# EAGLE design vfd_drive (EAGLE 9.2.2)
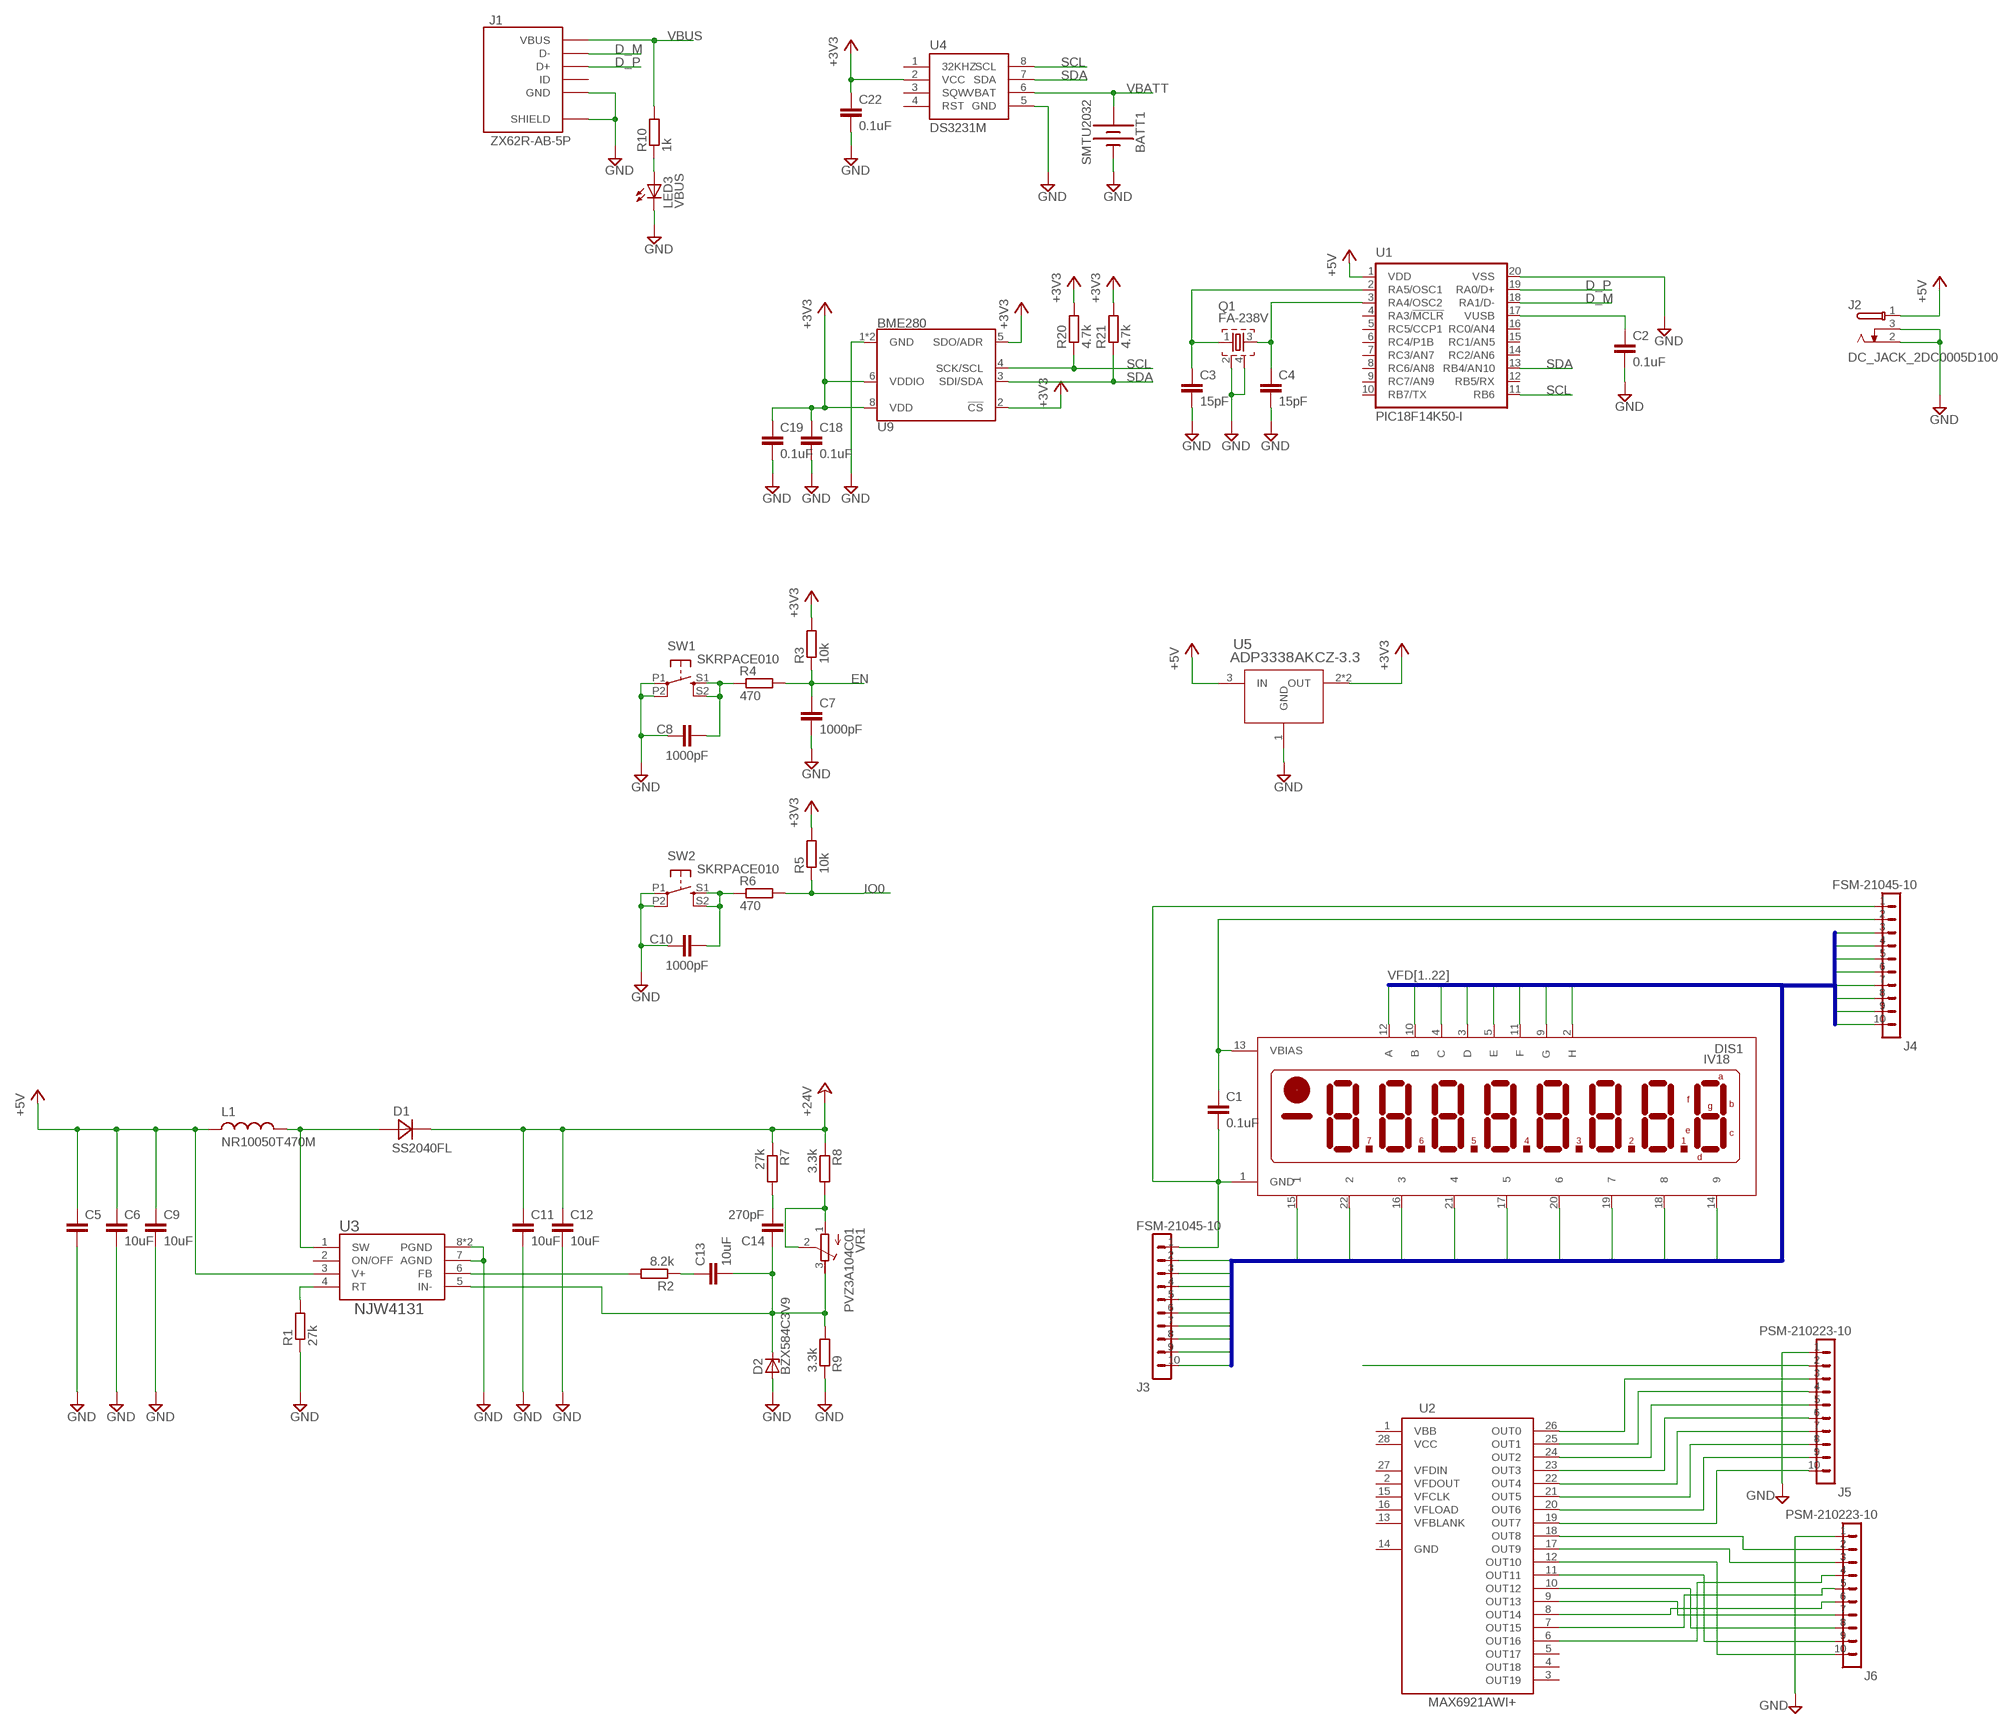
[diagram p0: schematic, sheet 1]

## Parts
BATT1  SMTU2032  [SMTU2032]
C1  0.1uF  C-EUC0603  [C0603]
C2  0.1uF  C-EUC0603  [C0603]
C3  15pF  C-EUC0603  [C0603]
C4  15pF  C-EUC0603  [C0603]
C5  C-EUC3225  [C3225]
C6  10uF  C-EUC0603  [C0603]
C7  1000pF  C-EUC0603  [C0603]
C8  1000pF  C-EUC0603  [C0603]
C9  10uF  C-EUC0603  [C0603]
C10  1000pF  C-EUC0603  [C0603]
C11  10uF  C-EUC3216  [C3216]
C12  10uF  C-EUC3216  [C3216]
C13  10uF  C-EUC0603  [C0603]
C14  270pF  C-EUC0603  [C0603]
C18  0.1uF  C-EUC0603  [C0603]
C19  0.1uF  C-EUC0603  [C0603]
C22  0.1uF  C-EUC0603  [C0603]
D1  SS2040FL  [SOD-123FL]
D2  BZX584C3V9  [SOD-523]
DIS1  IV18  [IV18]
J1  ZX62R-AB-5P  [ZX62R-B-5PA]
J2  DC_JACK_2DC0005D100  [DC_JACK_2DC0005D100]
J3  FSM-21045-10  [FSM-21045-10]
J4  FSM-21045-10  [FSM-21045-10]
J5  PSM-210223-10  [PSM-210223-10]
J6  PSM-210223-10  [PSM-210223-10]
L1  NR10050T470M  [NR10050T100M]
LED3  VBUS  LEDCHIPLED_0603  [CHIPLED_0603]
Q1  FA-238V  [FA238-V]
R1  27k  R-EU_R0603  [R0603]
R2  8.2k  R-EU_R0603  [R0603]
R3  10k  R-EU_R0603  [R0603]
R4  470  R-EU_R0603  [R0603]
R5  10k  R-EU_R0603  [R0603]
R6  470  R-EU_R0603  [R0603]
R7  27k  R-EU_R0603  [R0603]
R8  3.3k  R-EU_R0603  [R0603]
R9  3.3k  R-EU_R0603  [R0603]
R10  1k  R-EU_R0603  [R0603]
R20  4.7k  R-EU_R0603  [R0603]
R21  4.7k  R-EU_R0603  [R0603]
SW1  SKRPACE010  [SKRPACE010]
SW2  SKRPACE010  [SKRPACE010]
U1  PIC18F14K50-I  [SSOP20]
U2  MAX6921AWI+  [SOIC-28-MI]
U3  NJW4131  [HSOP8]
U4  DS3231M  [SO08]
U5  ADP3338AKCZ-3.3  [SOT233]
U9  BME280  [LGA-8-2.5X2.5]
VR1  PVZ3A104C01  [PVZ3A]

## Nets
+3V3 [POWER]: C18.1 C19.1 C22.1 R3.2 R5.2 R20.2 R21.2 U4.2(VCC) U5.2(OUT) U5.4(OUT) U9.2(!CS) U9.5(SDO/ADR) U9.6(VDDIO) U9.8(VDD)
+5V: C5.1 C6.1 C9.1 J2.1 L1.P$1 U1.1(VDD) U3.3(V+) U5.3(IN)
+24V: C11.1 C12.1 D1.K(C) R7.1 R8.1
D_M [diffrencial pair]: J1.D- U1.18(RA1/D-)
D_P [diffrencial pair]: J1.D+ U1.19(RA0/D+)
EN: C7.1 R3.1 R4.2
GND: BATT1.N(-) C1.2 C2.2 C3.2 C4.2 C5.2 C6.2 C7.2 C8.1 C9.2 C10.1 C11.2 C12.2 C18.2 C19.2 C22.2 D2.A DIS1.1(GND) J1.GND J1.SHIELD@1(SHIELD) J1.SHIELD@2(SHIELD) J1.SHIELD@3(SHIELD) J1.SHIELD@4(SHIELD) J2.2 J2.3 J3.1 J4.1 J5.1 J6.1 LED3.C Q1.2 Q1.4 R1.1 R9.1 SW1.P1(P) SW1.P2(P1) SW2.P1(P) SW2.P2(P1) U1.20(VSS) U3.7(AGND) U3.8(PGND) U3.PAD(PGND) U4.5(GND) U5.1(GND) U9.1(GND) U9.7(GND)
IO0: R5.1 R6.2
N$6: C8.2 R4.1 SW1.S1(S) SW1.S2(S1)
N$12: C10.2 R6.1 SW2.S1(S) SW2.S2(S1)
N$13: LED3.A R10.1
N$21: J5.3 U2.26(OUT0)
N$22: J5.4 U2.25(OUT1)
N$23: J5.5 U2.24(OUT2)
N$24: J5.6 U2.23(OUT3)
N$25: J5.7 U2.22(OUT4)
N$26: J5.8 U2.21(OUT5)
N$27: J5.9 U2.20(OUT6)
N$28: J5.10 U2.19(OUT7)
N$29: J6.2 U2.18(OUT8)
N$30: J6.7 U2.9(OUT13)
N$31: J6.8 U2.10(OUT12)
N$32: J6.9 U2.11(OUT11)
N$33: J6.10 U2.12(OUT10)
N$34: J6.3 U2.17(OUT9)
N$35: J6.6 U2.8(OUT14)
N$36: J6.5 U2.7(OUT15)
N$37: J6.4 U2.6(OUT16)
N$38: J5.2
N$39: C2.1 U1.17(VUSB)
N$40: R1.2 U3.4(RT)
N$41: D1.A L1.P$2 U3.1(SW)
N$43: R2.2 U3.6(FB)
N$44: C3.1 Q1.1 U1.2(RA5/OSC1)
N$45: C4.1 Q1.3 U1.3(RA4/OSC2)
N$46: C13.1 R2.1
N$47: C13.2 C14.1 D2.K(C) R9.2 U3.5(IN-) VR1.3(A)
N$48: C14.2 R7.2
N$49: R8.2 VR1.1(E) VR1.2(S)
SCL: R20.1 U1.11(RB6) U4.8(SCL) U9.4(SCK/SCL)
SDA: R21.1 U1.13(RB4/AN10) U4.7(SDA) U9.3(SDI/SDA)
VBATT: BATT1.P(+) U4.6(VBAT)
VBIAS: C1.1 DIS1.13(VBIAS) J4.2
VBUS: J1.VCC(VBUS) R10.2
VFD2: DIS1.2(H) J3.5
VFD3: DIS1.3(D) J3.4
VFD4: DIS1.4(C) J3.3
VFD5: DIS1.5(E) J3.2
VFD9: DIS1.9(G) J4.3
VFD10: DIS1.10(B) J4.4
VFD11: DIS1.11(F) J4.5
VFD12: DIS1.12(A) J4.6
VFD14: DIS1.14 J4.7
VFD15: DIS1.15 J4.8
VFD16: DIS1.16 J4.9
VFD17: DIS1.17 J4.10
VFD18: DIS1.18 J3.10
VFD19: DIS1.19 J3.9
VFD20: DIS1.20 J3.8
VFD21: DIS1.21 J3.7
VFD22: DIS1.22 J3.6
Unconnected: J1.ID U1.4(RA3/!MCLR!) U1.5(RC5/CCP1) U1.6(RC4/P1B) U1.7(RC3/AN7) U1.8(RC6/AN8) U1.9(RC7/AN9) U1.10(RB7/TX) U1.12(RB5/RX) U1.14(RC2/AN6) U1.15(RC1/AN5) U1.16(RC0/AN4) U2.1(VBB) U2.2(VFDOUT) U2.3(OUT19) U2.4(OUT18) U2.5(OUT17) U2.13(VFBLANK) U2.14(GND) U2.15(VFCLK) U2.16(VFLOAD) U2.27(VFDIN) U2.28(VCC) U3.2(ON/OFF) U4.1(32KHZ) U4.3(SQW) U4.4(RST)

## Buses
VFD[1..22]

## Library data of the parts
BATT1 = taki-library:SMTU2032
C1-C14 C18 C19 C22 = taki-library:C-EU: CAPACITOR, European symbol
D1 = taki-library:SS2040FL
D2 = taki-library:BZX584C3V9
DIS1 = taki-library:IV18: LCD DISPLAY 8-character 7 segment
J1 = taki-library:ZX62
J2 = taki-library:DC_JACK_2DC0005D100: AKIZUKIDENSHI 2DC-0005D100 SINGATRON ENTERPRISE CO., LTD http://akizukidenshi.com/download/2DC-0005D100.pdf
J3 J4 = taki-library:FSM-21045-10
J5 J6 = taki-library:PSM-210223-10
L1 = taki-library:NR10050T470M
LED3 = taki-library:LED: LED OSRAM: - CHIPLED LG R971, LG N971, LY N971, LG Q971, LY Q971, LO R971, LY R971 LH N974, LH R974 LS Q976, LO Q976, LY Q976 LO Q996 - Hyper CHIPLED LW Q18S LB Q993, LB Q99A, LB R99A - SideLED LS A670, LO A670, LY A670, LG A670, LP A670 LB A673, LV A673, LT A673, LW A673 LH A674 LY A675 LS A676, LA A676, LO A676, LY A676, LW A676 LS A679, LY A679, LG A679 - Hyper Micro SIDELED® LS Y876, LA Y876, LO Y876, LY Y876 LT Y87S - SmartLED LW L88C, LW L88S LB L89C, LB L89S, LG L890 LS L89K, LO L89K, LY L89K LS L896, LA L896, LO L896, LY L896 - TOPLED LS T670, LO T670, LY T670, LG T670, LP T670 LSG T670, LSP T670, LSY T670, LOP T670, LYG T670 LG T671, LOG T671, LSG T671 LB T673, LV T673, LT T673, LW T673 LH T674 LS T676, LA T676, LO T676, LY T676, LB T676, LH T676, LSB T676, LW T676 LB T67C, LV T67C, LT T67C, LS T67K, LO T67K, LY T67K, LW E67C LS E67B, LA E67B, LO E67B, LY E67B, LB E67C, LV E67C, LT E67C LW T67C LS T679, LY T679, LG T679 LS T770, LO T770, LY T770, LG T770, LP T770 LB T773, LV T773, LT T773, LW T773 LH T774 LS E675, LA E675, LY E675, LS T675 LS T776, LA T776, LO T776, LY T776, LB T776 LHGB T686 LT T68C, LB T68C - Hyper Mini TOPLED® LB M676 - Mini TOPLED Santana® LG M470 LS M47K, LO M47K, LY M47K Source: http://www.osram.convergy.de LUXEON: - LUMILED® LXK2-PW12-R00, LXK2-PW12-S00, LXK2-PW14-U00, LXK2-PW14-V00 LXK2-PM12-R00, LXK2-PM12-S00, LXK2-PM14-U00 LXK2-PE12-Q00, LXK2-PE12-R00, LXK2-PE12-S00, LXK2-PE14-T00, LXK2-PE14-U00 LXK2-PB12-K00, LXK2-PB12-L00, LXK2-PB12-M00, LXK2-PB14-N00, LXK2-PB14-P00, LXK2-PB14-Q00 LXK2-PR12-L00, LXK2-PR12-M00, LXK2-PR14-Q00, LXK2-PR14-R00 LXK2-PD12-Q00, LXK2-PD12-R00, LXK2-PD12-S00 LXK2-PH12-R00, LXK2-PH12-S00 LXK2-PL12-P00, LXK2-PL12-Q00, LXK2-PL12-R00 Source: www.luxeon.com KINGBRIGHT: KA-3528ASYC Source: www.kingbright.com
Q1 = taki-library:FA-238V
R1-R10 R20 R21 = taki-library:R-EU_: RESISTOR, European symbol
SW1 SW2 = taki-library:SKRPACE010
U1 = taki-library:PIC18F14K50-I
U2 = taki-library:MAX6921AWI+
U3 = taki-library:NJW4131
U4 = taki-library:DS3231M: DS3231M Real Time Clock Accuracy +/-5ppm. Battery Backup. 2.3V to 5.5V. Datasheet <https://cdn.sparkfun.com/datasheets/Dev/Beagle/DS3231M.pdf> SparkFun Products CryptoCape <https://www.sparkfun.com/products/12773> (DEV-12773) SparkFun CryptoShield <https://www.sparkfun.com/products/13183> (DEV-13183); PROD_ID: IC-11985
U5 = taki-library:ADP3338AKCZ-3.3
U9 = taki-library:BME280: Bosch BME280 – Combined Humidity and Pressure Sensor The BME280 is as combined digital humidity, pressure and temperature sensor based on proven sensing principles. The sensor module is housed in an extremely compact metal-lid LGA package with a footprint of only 2.5×2.5mm² with a height of 0.93mm. Its small dimensions and its low power consumption allow the implementation in battery driven devices such as handsets, GPS modules or watches. Datasheet <https://cdn.sparkfun.com/assets/learn_tutorials/4/1/9/BST-BME280_DS001-10.pdf> SparkFun Products SparkFun Atmospheric Sensor Breakout - BME280 <https://www.sparkfun.com/products/13676> (SEN-13676); PROD_ID: IC-13090
VR1 = taki-library:PVZ3A104C01

## Net classes
0 default: width 0.152 mm
1 POWER: width 0.254 mm
2 diffrencial pair: width 0.15 mm, clearance 0.3 mm to class 0, clearance 0.3 mm to class 1, clearance 0.15 mm
3 3pin digital: width 0.15 mm
4 high-voltage: width 0.3 mm, clearance 0.7 mm to class 0, clearance 0.7 mm to class 1, clearance 0.7 mm to class 2, clearance 0.7 mm to class 3, clearance 0.7 mm

## Board
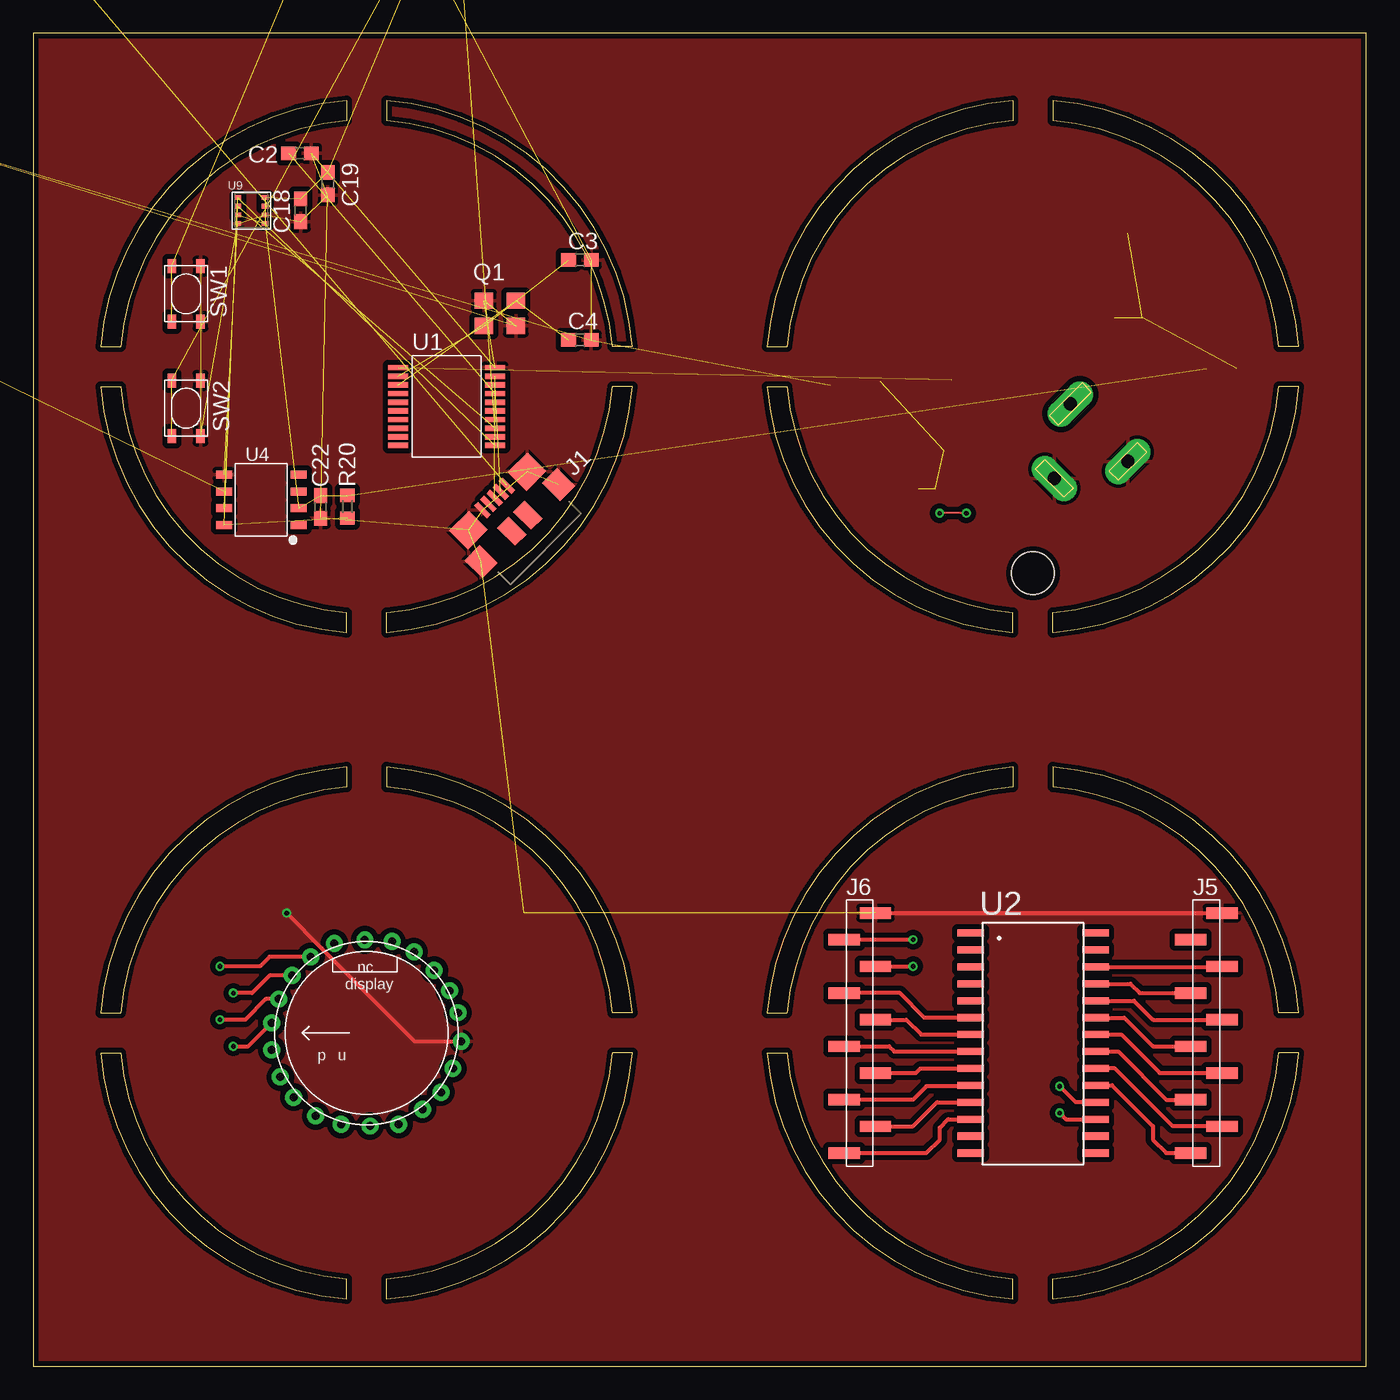
[diagram p1: board, top side]
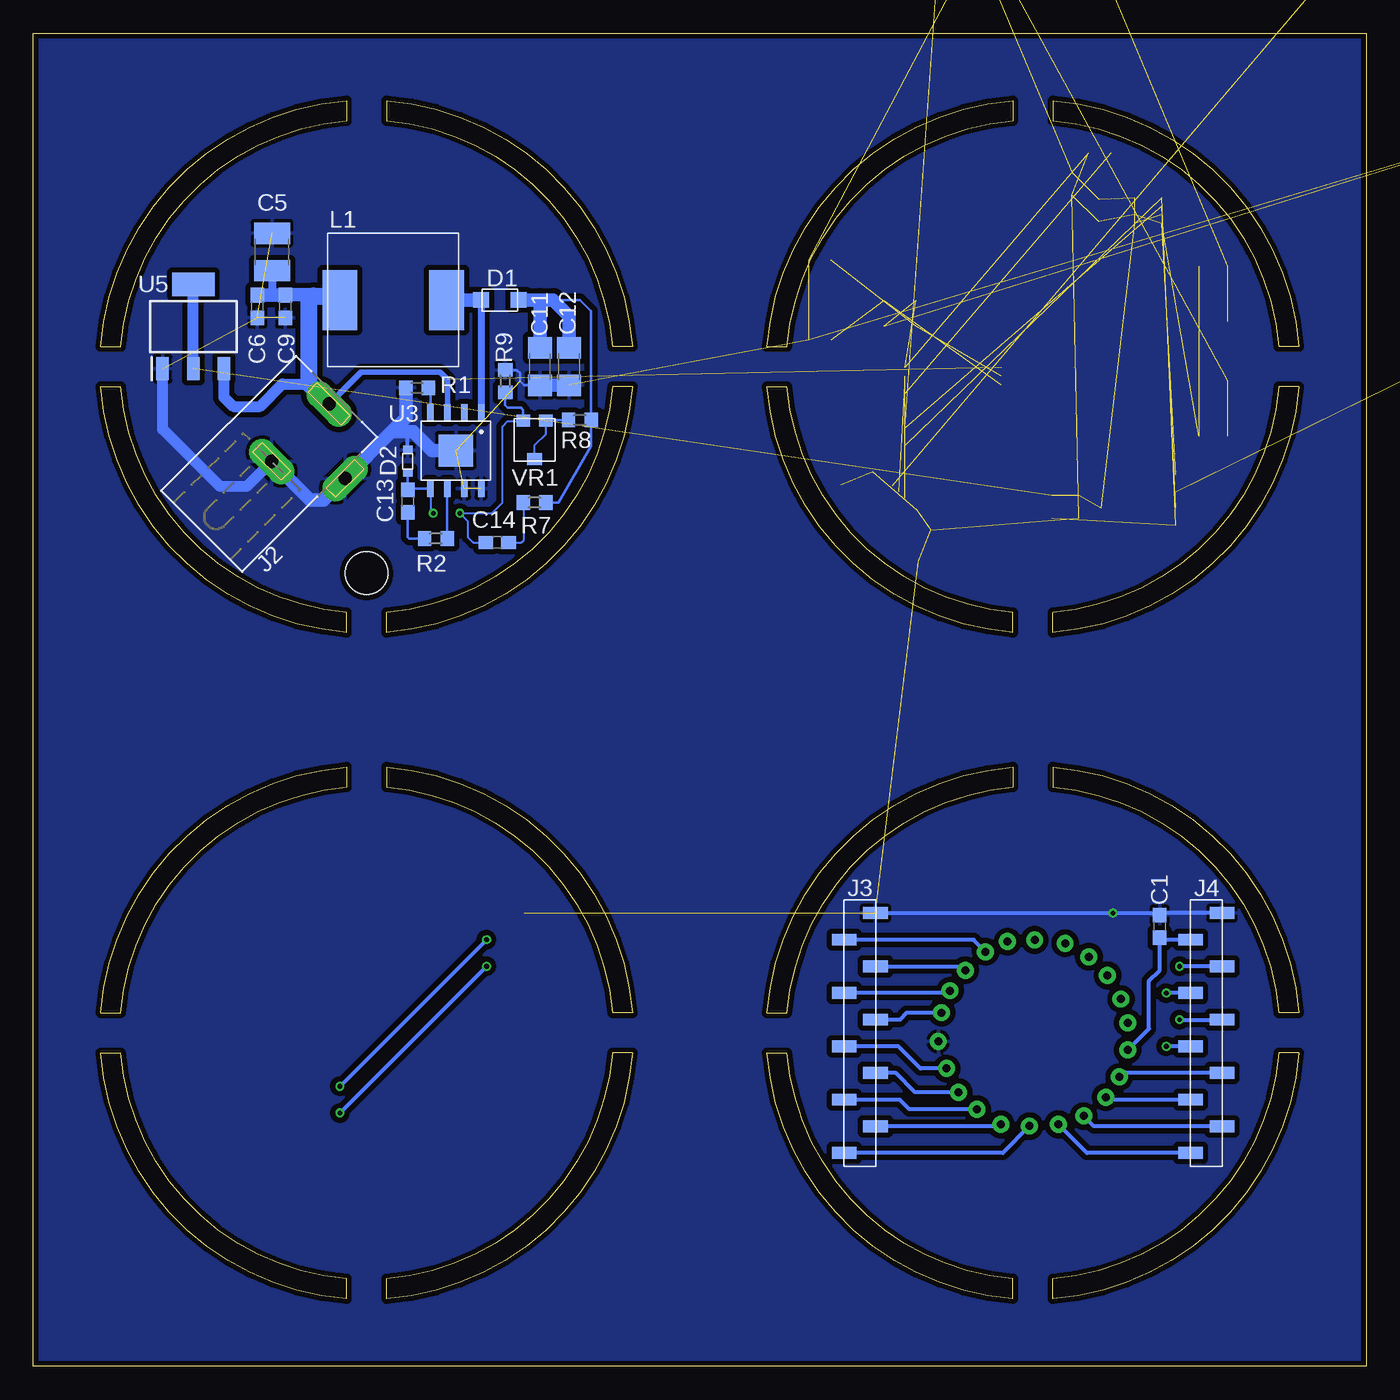
[diagram p2: board, bottom side, seen from below]

Size 100 x 100 mm. Coordinates in mm from the lower left corner, seen from the top.
Outline: 23.5,43.44 arc81 6.56,26.5 5.06,26.5 arc-81 23.5,44.94 23.5,43.44
Outline: 43.44,26.5 arc81 26.5,43.44 26.5,44.94 arc-81 44.94,26.5 43.44,26.5
Outline: 6.56,23.5 arc81 23.5,6.56 23.5,5.06 arc-81 5.06,23.5 6.56,23.5
Outline: 26.5,6.56 arc81 43.44,23.5 44.94,23.5 arc-81 26.5,5.06 26.5,6.56
Outline: 56.56,23.5 arc81 73.5,6.56 73.5,5.06 arc-81 55.06,23.5 56.56,23.5
Outline: 0,0 100,0 100,100 0,100 0,0
Outline: 73.5,43.44 arc81 56.56,26.5 55.06,26.5 arc-81 73.5,44.94 73.5,43.44
Outline: 76.5,6.56 arc81 93.44,23.5 94.94,23.5 arc-81 76.5,5.06 76.5,6.56
Outline: 93.44,26.5 arc81 76.5,43.44 76.5,44.94 arc-81 94.94,26.5 93.44,26.5
Outline: 76.5,56.56 arc81 93.44,73.5 94.94,73.5 arc-81 76.5,55.06 76.5,56.56
Outline: 56.56,73.5 arc81 73.5,56.56 73.5,55.06 arc-81 55.06,73.5 56.56,73.5
Outline: 93.44,76.5 arc81 76.5,93.44 76.5,94.94 arc-81 94.94,76.5 93.44,76.5
Outline: 73.5,93.44 arc81 56.56,76.5 55.06,76.5 arc-81 73.5,94.94 73.5,93.44
Outline: 43.44,76.5 arc81 26.5,93.44 26.5,94.94 arc-81 44.94,76.5 43.44,76.5
Outline: 26.5,56.56 arc81 43.44,73.5 44.94,73.5 arc-81 26.5,55.06 26.5,56.56
Outline: 23.5,93.44 arc81 6.56,76.5 5.06,76.5 arc-81 23.5,94.94 23.5,93.44
Outline: 6.56,73.5 arc81 23.5,56.56 23.5,55.06 arc-81 5.06,73.5 6.56,73.5
Copper layers (1*16): Top 0.035mm / dielectric 1.5mm / Bottom 0.035mm
Design rules "Elecrow_2-layer_eagle_rule": minimum track width 6mil, minimum drill 12mil, track to track 6mil, track to pad 6mil, pad to pad 6mil, via to via 6mil, smd to smd 0mil, copper to edge 10mil, drill to drill 10mil, minimum pad ring 10mil, minimum via ring 6mil, stop-mask expansion 2mil, vias tented up to drill 100mil, thermal gap 10mil
Holes 3.2 mm at 75,59.5

### Footprints (pad centres in the part's own frame; a part is rotated, then mirrored left to right if it is on the bottom)
SMTU2032 = smd 2.6 x 3.5: N 14.7,0; P -14.7,0
C0603 = smd 1.1 x 1: 1 -0.85,0; 2 0.85,0
C3225 = smd 1.6 x 2.7: 1 -1.4,0; 2 1.4,0
C3216 = smd 1.6 x 1.8: 1 -1.4,0; 2 1.4,0
SOD-123FL = smd 1.2 x 1.2: A -1.4,0; K 1.4,0
SOD-523 = smd 0.6 x 0.7: A -0.85,0; K 0.85,0
IV18 = drill 0.6 pad 1.27: 1 -0.635,-7.112; 2 1.524,-6.858; 3 3.175,-6.223; 4 4.699,-5.08; 5 6.096,-3.556; 6 6.858,-1.905; 7 6.985,0.127; 8 6.731,2.413; 9 5.715,4.191; 10 4.318,5.588; 11 2.54,6.604; 12 0.762,7.112; 13 -1.27,7.112; 14 -3.302,6.477; 15 -4.826,5.461; 16 -6.223,3.81; 17 -6.858,1.905; 18 -6.985,-0.254; 19 -6.858,-2.413; 20 -5.715,-4.191; 21 -4.445,-5.588; 22 -2.667,-6.477
ZX62R-B-5PA = smd 0.4 x 1.35: D+ 0,2.675; D- 0.65,2.675; GND -1.3,2.675; ID -0.65,2.675; VCC 1.3,2.675 | smd 1.2 x 1.9: NC@1 -0.85,0; NC@2 0.85,0 | smd 2.1 x 2: SHIELD@1 -3.1,2.35; SHIELD@2 3.1,2.35 | smd 1.6 x 1.9: SHIELD@3 -4.1,0; SHIELD@4 4.1,0
DC_JACK_2DC0005D100 = drill 1 pad 2 long: 1 -3.1,0; 2 3,0; 3 0,4.8
FSM-21045-10 = smd 0.89 x 1.85: 1 0,1.175; 2 2,-1.175; 3 4,1.175; 4 6,-1.175; 5 8,1.175; 6 10,-1.175; 7 12,1.175; 8 14,-1.175; 9 16,1.175; 10 18,-1.175
PSM-210223-10 = smd 0.85 x 2.35: 1 0,1.175; 2 2,-1.175; 3 4,1.175; 4 6,-1.175; 5 8,1.175; 6 10,-1.175; 7 12,1.175; 8 14,-1.175; 9 16,1.175; 10 18,-1.175
NR10050T100M = smd 2.6 x 4.5: P$1 -4,0; P$2 4,0
CHIPLED_0603 = smd 0.8 x 0.8: A 0,-0.75; C 0,0.75
FA238-V = smd 1.4 x 1.2: 1 -1.2,-0.95; 2 1.2,-0.95; 3 1.2,0.95; 4 -1.2,0.95
R0603 = smd 1 x 1.1: 1 -0.85,0; 2 0.85,0
SKRPACE010 = smd 1.05 x 0.65: P1 -2.075,-1.075; P2 2.075,-1.075; S1 -2.075,1.075; S2 2.075,1.075
SSOP20 = smd 0.4 x 1.5: 1 -2.925,-3.625; 2 -2.275,-3.625; 3 -1.625,-3.625; 4 -0.975,-3.625; 5 -0.325,-3.625; 6 0.325,-3.625; 7 0.975,-3.625; 8 1.625,-3.625; 9 2.275,-3.625; 10 2.925,-3.625; 11 2.925,3.625; 12 2.275,3.625; 13 1.625,3.625; 14 0.975,3.625; 15 0.325,3.625; 16 -0.325,3.625; 17 -0.975,3.625; 18 -1.625,3.625; 19 -2.275,3.625; 20 -2.925,3.625
SOIC-28-MI = smd 0.533 x 1.981: 1 0,-4.686; 2 1.27,-4.686; 3 2.54,-4.686; 4 3.81,-4.686; 5 5.08,-4.686; 6 6.35,-4.686; 7 7.62,-4.686; 8 8.89,-4.686; 9 10.16,-4.686; 10 11.43,-4.686; 11 12.7,-4.686; 12 13.97,-4.686; 13 15.24,-4.686; 14 16.51,-4.686; 15 16.51,4.686; 16 15.24,4.686; 17 13.97,4.686; 18 12.7,4.686; 19 11.43,4.686; 20 10.16,4.686; 21 8.89,4.686; 22 7.62,4.686; 23 6.35,4.686; 24 5.08,4.686; 25 3.81,4.686; 26 2.54,4.686; 27 1.27,4.686; 28 0,4.686
HSOP8 = smd 0.5 x 1.27: 1 -1.905,-2.858; 2 -0.635,-2.858; 3 0.635,-2.858; 4 1.905,-2.858; 5 1.905,2.858; 6 0.635,2.858; 7 -0.635,2.858; 8 -1.905,2.858 | smd 2.6 x 2.4: PAD 0,0
SO08 = smd 0.6 x 1.2: 1 -1.905,-2.8; 2 -0.635,-2.8; 3 0.635,-2.8; 4 1.905,-2.8; 5 1.905,2.8; 6 0.635,2.8; 7 -0.635,2.8; 8 -1.905,2.8
SOT233 = smd 1.75 x 0.95: 1 -3.15,2.3; 2 -3.15,0; 3 -3.15,-2.3 | smd 1.75 x 3.2: 4 3.15,0
LGA-8-2.5X2.5 = smd 0.35 x 0.5: 1 -0.975,1.025; 2 -0.325,1.025; 3 0.325,1.025; 4 0.975,1.025; 5 0.975,-1.025; 6 0.325,-1.025; 7 -0.325,-1.025; 8 -0.975,-1.025
PVZ3A = smd 1 x 0.9: 1 -0.85,-1.45; 3 0.85,-1.45 | smd 1.1 x 0.9: 2 0,1.45

### Placement (x,y rotation side)
BATT1  -27.49,93.31 180 bottom  (outside the outline)
C1  15.5,33 90 bottom
C2  20,91 0 top
C3  41,83 0 top
C4  41,77 0 top
C5  82.1,83.6 90 bottom
C6  83.2,79.5 270 bottom
C7  27.16,111.65 270 top  (outside the outline)
C8  23.9,113.88 90 top  (outside the outline)
C9  81.1,79.5 270 bottom
C10  33.48,114.62 180 top  (outside the outline)
C11  62,75 270 bottom
C12  59.8,75 270 bottom
C13  71.9,64.9 90 bottom
C14  65.2,61.8 0 bottom
C18  20.05,86.72 270 top
C19  22.09,88.72 270 top
C22  21.56,64.47 270 top
D1  65,80 0 bottom
D2  71.9,67.9 270 bottom
DIS1  25,25 90 top
J1  36.5,63.25 45 top
J2  80,70 225 bottom
J3  38,34 270 bottom
J4  12,34 270 bottom
J5  88,34 270 top
J6  62,34 270 top
L1  73,80 0 bottom
LED3  -0.09,116.76 0 top  (outside the outline)
Q1  35,79 0 top
R1  71.2,73.4 0 bottom
R2  69.8,62.1 0 bottom
R3  27.18,117.26 90 top  (outside the outline)
R4  26.42,114.52 0 top  (outside the outline)
R5  29.9,118.12 180 top  (outside the outline)
R6  32.64,117.29 90 top  (outside the outline)
R7  62.4,64.8 180 bottom
R8  59,71 180 bottom
R9  64.6,73.9 270 bottom
R10  -0.09,108.84 270 top  (outside the outline)
R20  23.57,64.48 90 top
R21  31.73,111.68 90 top  (outside the outline)
SW1  11.47,80.45 90 top
SW2  11.47,71.87 90 top
U1  31,72 270 top
U2  75,32.5 270 top
U3  68.3,68.7 180 bottom
U4  17.1,65 90 top
U5  88,78 90 bottom
U9  16.36,86.7 90 top
VR1  62.4,69.5 180 bottom

### Tracks (layer width: path | path; a pad name or v marks a point on that pad's centre or on a via)
+3V3  (12 unrouted)
  Bottom 0.813: U5.2 U5.4
+5V  (1 unrouted)
  Bottom 0.406: U3.3 68.94,74.03 69.5,74.6 75.4,74.6 J2.1
  Bottom 0.61: 82.1,80.45 82.2,80.55 | C5.1 82.1,80.45 | 82.1,80.45 82,80.35
  Bottom 0.813: U5.3 85.7,72.7 85,72 83,72 81.32,73.68 79.3,73.68
  Bottom 1.016: 77.4,80.4 81.05,80.4 C9.1 82,80.35 C6.1
  Bottom 1.27: J2.1 79.3,73.68 79.3,80 79,80.3 77.3,80.3 | 77.4,80.4 77.3,80.3 | 77.3,80.3 L1.P$1
+24V
  Bottom 0.203: D1.K 59,80 58.15,79.15 R8.1 58.15,69.02 60.6,64.8 R7.1
  Bottom 1.016: D1.K 62,80 | 62,80 61,80 59.8,78.8 C12.1 | C11.1 62,80
D_M  (1 unrouted)
D_P  (1 unrouted)
EN  (2 unrouted)
GND  (via drill 0.35)  (34 unrouted)
  Top 0.305: J6.1 J5.1 | v19,34 21.65,31.35 21.65,31.34 28.62,24.36 DIS1.1
  Bottom 0.203: C11.2 63.2,73.6 63.5,73.9 63.5,74.5 63.75,74.75 R9.1
  Bottom 0.305: D2.A 71.9,69.71 71.51,70.11 | J4.1 15.35,34 C1.2 15.65,34 v19,34 J3.1
  Bottom 0.813: J2.2 84,66 86,66 90.3,70.3 U5.1
  Bottom 1.016: C11.2 C12.2 | J2.2 79.24,65 78.21,65 J2.3 73.11,70.11 | 73.11,70.11 72.05,71.16 R1.1 | 73.11,70.11 71.51,70.11 70.1,68.7 U3.PAD
  pour Bottom (isolate 0.4): 103,100 103,0 0,0 0,100
  pour Top (isolate 0.4): 102,100 102,0 0,0 0,100
IO0  (1 unrouted)
N$6  (3 unrouted)
N$12  (3 unrouted)
N$13  (1 unrouted)
N$21
  Top 0.305: U2.26 89.14,29.96 J5.3
N$22
  Top 0.305: U2.25 82.31,28.69 83,28 J5.4
N$23
  Top 0.305: U2.24 82.58,27.42 84,26 J5.5
N$24
  Top 0.305: U2.23 81.85,26.15 84,24 J5.6
N$25
  Top 0.305: U2.22 81.62,24.88 84.5,22 J5.7
N$26
  Top 0.305: U2.21 81.39,23.61 85,20 J5.8
N$27
  Top 0.305: J5.9 85.5,18 81.16,22.34 U2.20
N$28
  Top 0.305: U2.19 80.93,21.07 84,18 84,17 85,16 J5.10
N$29  (via drill 0.35)
  Top 0.305: U2.18 78.2,19.8 v77,21 | v66,32 J6.2
  Bottom 0.305: v77,21 v66,32
N$30
  Top 0.305: J6.7 66.2,22 66.54,22.34 U2.9
N$31
  Top 0.305: U2.10 70.24,21 67,21 66,20 J6.8
N$32
  Top 0.305: J6.9 66,18 67.8,19.8 U2.11
N$33
  Top 0.305: J6.10 67,16 68,17 68,17.9 68.63,18.53 U2.12
N$34  (via drill 0.35)
  Top 0.305: J6.3 v66,30 | v77,19 77.47,18.53 U2.17
  Bottom 0.305: v66,30 v77,19
N$35
  Top 0.305: J6.6 64.2,24 64.59,23.61 U2.8
N$36
  Top 0.305: J6.5 65.5,26 66.62,24.88 U2.7
N$37
  Top 0.305: U2.6 66.85,26.15 65,28 J6.4
N$39  (1 unrouted)
N$40
  Bottom 0.203: U3.4 70.2,73.25 R1.2
N$41
  Bottom 0.508: D1.A U3.1
  Bottom 1.016: L1.P$2 D1.A
N$43
  Bottom 0.203: R2.2 68.95,65.83 U3.6
N$44  (2 unrouted)
N$45  (2 unrouted)
N$46
  Bottom 0.203: C13.1 71.9,62.2 71.8,62.1 R2.1
N$47  (via drill 0.35)
  Top 0.152: v70,64 v68,64
  Bottom 0.152: U3.5 70.2,64.2 v70,64 | C14.1 67,61.8 67.4,62.2 67.4,63.4 v68,64 65.6,64 64.8,64.8 64.8,70.5 64.4,70.9 63.3,70.9 VR1.3
  Bottom 0.203: VR1.3 63.25,71.75 63.4,71.9 64.4,71.9 64.6,72.1 R9.2 | U3.5 71.81,65.84 C13.2 D2.K
N$48
  Bottom 0.152: C14.2 63.4,61.8 63.2,62 63.2,64.75 R7.2
N$49
  Bottom 0.152: VR1.2 62.4,69.1 61.55,69.95 VR1.1
  Bottom 0.203: VR1.1 61.5,71 R8.2
SCL  (3 unrouted)
SDA  (3 unrouted)
VBATT  (1 unrouted)
VBIAS
  Bottom 0.305: J4.2 15.35,32 C1.1 15.5,29.7 16.3,28.9 16.3,25.32 DIS1.13
VBUS  (1 unrouted)
VFD2
  Bottom 0.305: DIS1.2 34.48,26.52 35,26 J3.5
VFD3
  Bottom 0.305: DIS1.3 31.4,28 J3.4
VFD4
  Bottom 0.305: J3.3 30.38,30 DIS1.4
VFD5
  Bottom 0.305: DIS1.5 29.46,32 J3.2
VFD9  (via drill 0.35)
  Top 0.305: DIS1.9 17.71,30.71 17,30 v14,30
  Bottom 0.305: J4.3 v14,30
VFD10  (via drill 0.35)
  Top 0.305: DIS1.10 17.72,29.32 16.4,28 v15,28
  Bottom 0.305: J4.4 v15,28
VFD11  (via drill 0.35)
  Top 0.305: DIS1.11 17.44,27.54 15.9,26 v14,26
  Bottom 0.305: v14,26 J4.5
VFD12  (via drill 0.35)
  Top 0.305: v15,24 16.13,24 DIS1.12
  Bottom 0.305: J4.6 v15,24
VFD14
  Bottom 0.305: DIS1.14 18.22,22 J4.7
VFD15
  Bottom 0.305: J4.8 19.36,20 DIS1.15
VFD16
  Bottom 0.305: J4.9 20.41,18 DIS1.16
VFD17
  Bottom 0.305: J4.10 20.95,16 DIS1.17
VFD18
  Bottom 0.305: DIS1.18 27.27,16 J3.10
VFD19
  Bottom 0.305: DIS1.19 27.55,18 J3.9
VFD20
  Bottom 0.305: DIS1.20 34.28,19.29 35,20 J3.8
VFD21
  Bottom 0.305: DIS1.21 33.85,20.55 35.3,22 J3.7
VFD22
  Bottom 0.305: DIS1.22 33.43,22.33 35.1,24 J3.6